# EAGLE design PPSB-TH (EAGLE 9.6.1)
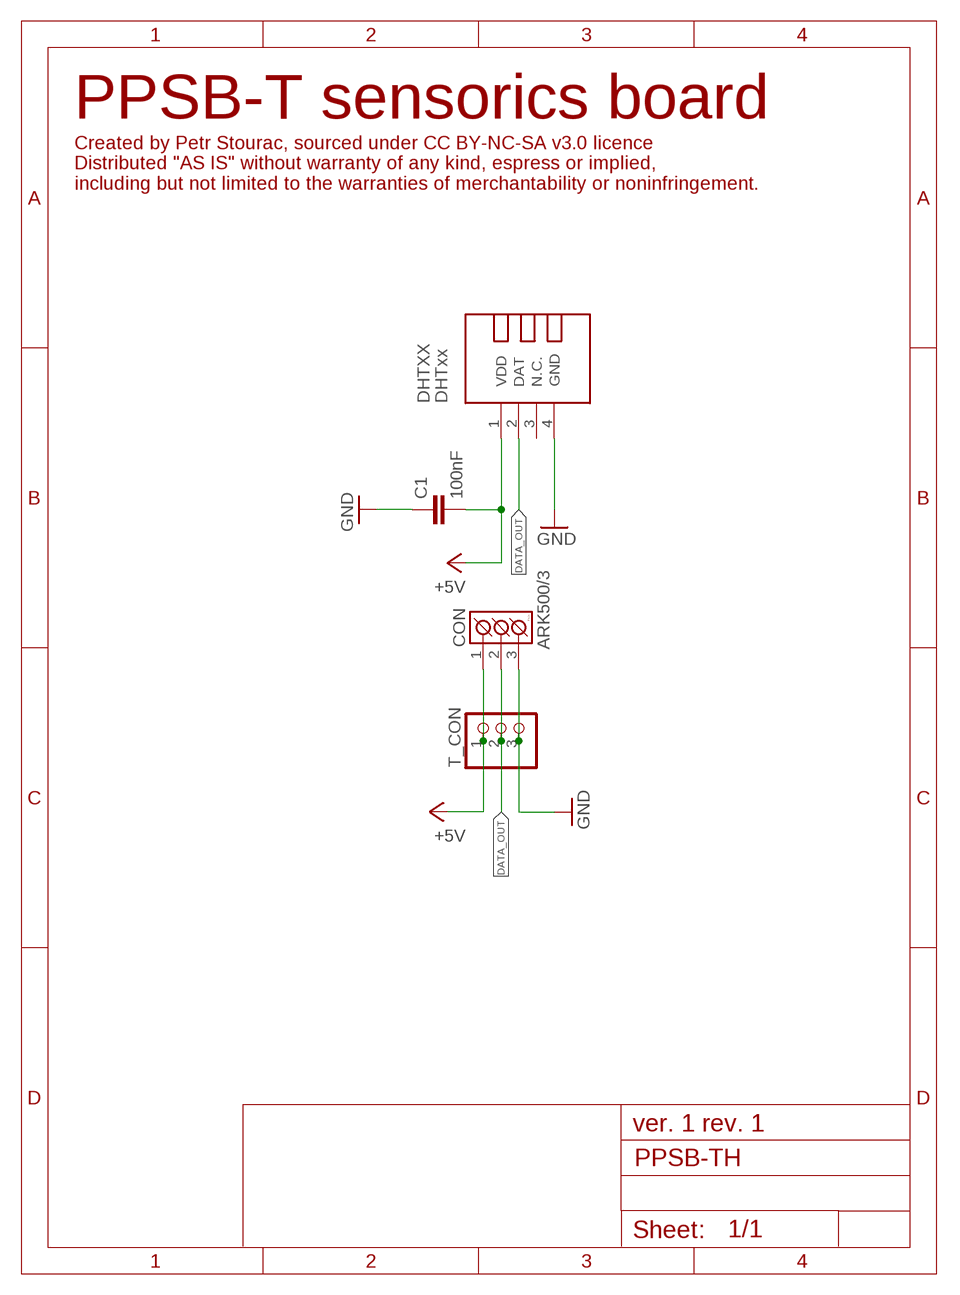
[diagram p0: schematic, sheet 1]

## Parts
C1  100nF  C-EUC0603  [C0603]
CON  ARK500/3  [ARK500/3]
DHTXX  DHTxx  TEMP-HUM-SENSOR-DHT22  [TEMP-HUM-SENSOR-DHT22]
T_CON  PINHD-1X3  [1X03]

## Nets
+5V: C1.2 CON.1(K1) DHTXX.1(VDD) T_CON.1
DATA_OUT: CON.2(K2) DHTXX.2(DAT) T_CON.2
GND: C1.1 CON.3(K3) DHTXX.4(GND) T_CON.3
Unconnected: DHTXX.3(N.C.)

## Notes on the sheet
- PPSB-T sensorics board
- Created by Petr Stourac, sourced under CC BY-NC-SA v3.0 licence
  Distributed "AS IS" without warranty of any kind, espress or implied, 
  including but not limited to the warranties of merchantability or noninfringement.
- ver. 1 rev. 1

## Library data of the parts
C1 = rcl:C-EU: CAPACITOR, European symbol; SPICEPREFIX: C
CON = #PaJa_konektory:ARK500/3: Svorkovnice - roztec 5mm - trojita
DHTXX = diy-modules:TEMP-HUM-SENSOR-DHT22: DHT22 - digital humidity & temperature sensor Also known as: AM2302 AM2302 datasheet available here: http://akizukidenshi.com/download/ds/aosong/AM2302.pdf Click here to find device on ebay.com <http://www.ebay.com/sch/dht22+digital+sensor>
T_CON = pinhead:PINHD-1X3: PIN HEADER

## Board
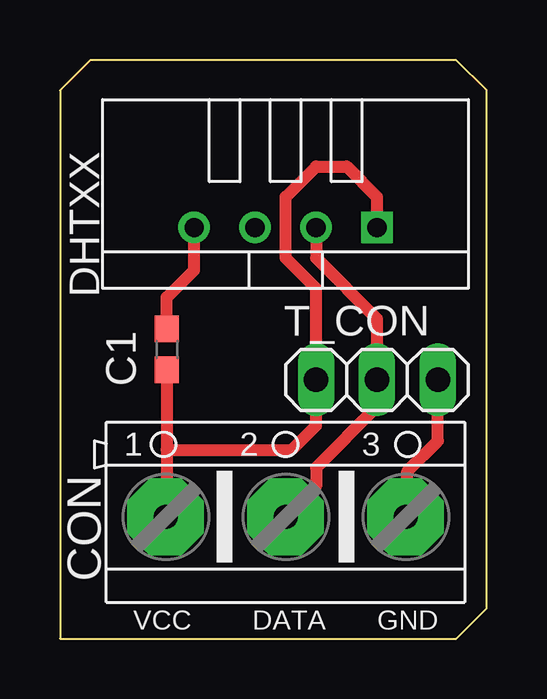
[diagram p1: board, top side]
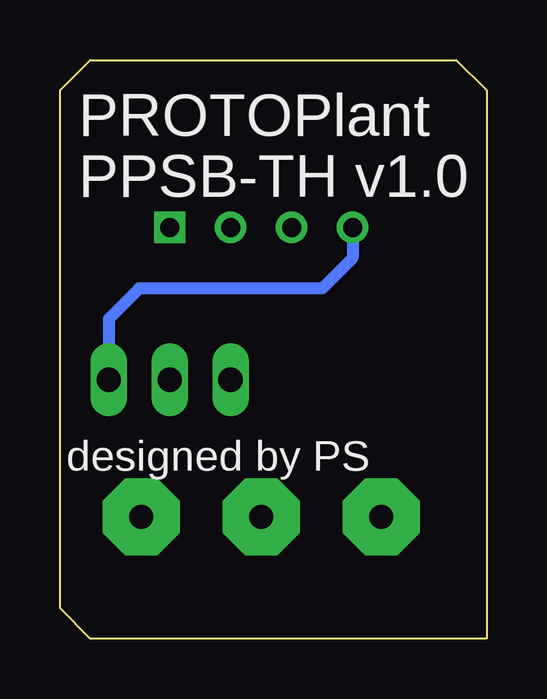
[diagram p2: board, bottom side, seen from below]

Size 17.78 x 24.13 mm. Coordinates in mm from the lower left corner, seen from the top.
Outline: 0,22.86 0,0 16.51,0 17.78,1.27 17.78,22.86 16.51,24.13 1.27,24.13 0,22.86
Copper layers (1*16): Top 0.035mm / dielectric 1.5mm / Bottom 0.035mm
Design rules "default": minimum track width 6mil, minimum drill 0.35mm, track to track 6mil, track to pad 6mil, pad to pad 6mil, via to via 6mil, smd to smd 6mil, copper to edge 40mil, drill to drill 6mil, minimum pad ring 10mil, minimum via ring 8mil, stop-mask expansion 4mil, vias tented up to drill 0mil, thermal gap 10mil

### Footprints (pad centres in the part's own frame; a part is rotated, then mirrored left to right if it is on the bottom)
C0603 = smd 1.1 x 1: 1 -0.85,0; 2 0.85,0
ARK500/3 = drill 1 pad 3.2 octagon: 1 -5,0; 2 0,0; 3 5,0
TEMP-HUM-SENSOR-DHT22 = drill 0.8 square: 1 -3.81,0 | drill 0.8: 2 -1.27,0; 3 1.27,0; 4 3.81,0
1X03 = drill 1.016 long: 1 -2.54,0; 2 0,0; 3 2.54,0

### Placement (x,y rotation side)
C1  4.45,12.06 270 top
CON  9.4,5.08 0 top
DHTXX  9.4,17.14 180 top
T_CON  13.21,10.79 0 top

### Tracks (layer width: path | path; a pad name or v marks a point on that pad's centre or on a via)
+5V
  Top 0.508: C1.2 4.45,7.87 | 4.45,7.87 4.45,5.13 CON.1 | 4.45,7.87 9.65,7.87 10.67,8.89 T_CON.1 10.67,14.61 9.4,15.88 9.4,18.41 10.67,19.68 11.94,19.68 13.21,18.41 DHTXX.1
DATA_OUT
  Top 0.508: CON.2 10.67,6.35 10.67,7.11 13.21,9.65 T_CON.2 13.21,13.34 10.67,15.88 DHTXX.2
GND
  Top 0.508: CON.3 14.48,5.16 14.48,6.99 15.75,8.26 T_CON.3 | C1.1 4.45,14.22 5.59,15.37 DHTXX.4
  Bottom 0.508: DHTXX.4 5.59,15.88 6.86,14.61 14.48,14.61 15.75,13.34 T_CON.3

### Text on the board
tNames: VCC | DATA | GND
bNames: PROTOPlant | PPSB-TH v1.0 | designed by PS